# Altium schematic sheet LED.SchDoc
size A; SheetNumber: 1; SheetTotal: 1
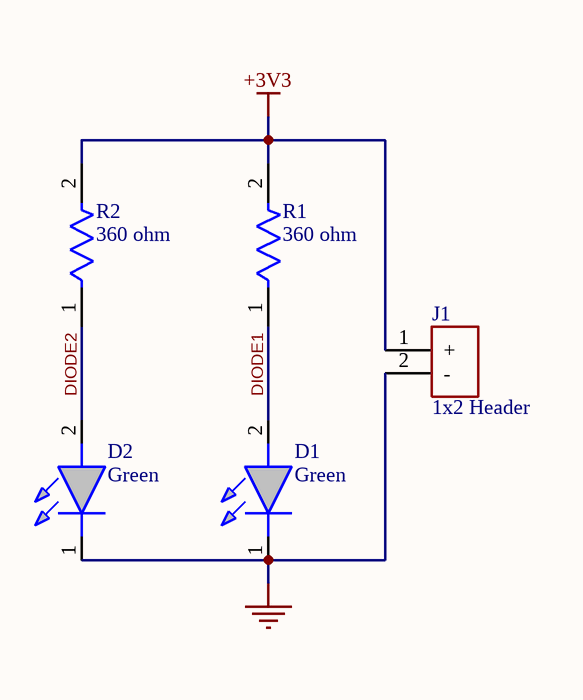
[diagram p0: LED.SchDoc]

## Parts
D1  Green  [LED0603Green]
D2  Green  [LED0603Green]
J1  1x2 Header  [HDR1x2]
R1  360 ohm  [R0805]
R2  360 ohm  [R0805]

## Nets
+3V3: J1.1(+) R1.2 R2.2
GND: D1.1(K) D2.1(K) J1.2(-)
DIODE1: D1.2(A) R1.1
DIODE2: D2.2(A) R2.1

## Library data of the parts
D1 D2 = LSM0603453V: Standard LEDs - SMD SMD 0603 3V 1000mcd GREEN; Manufacturer_Name: Visual Communications Company; Geometry.Height: 0.55mm; Mouser Part Number: 593-LSM0603453V; Mouser Price/Stock: https://www.mouser.co.uk/ProductDetail/VCC/LSM0603453V?qs=%252BEew9%252B0nqrBOKWP8d%2FyQXQ%3D%3D; Manufacturer_Part_Number: LSM0603453V; Datasheet Link: https://vcclite.com/wp-content/uploads/wpallimport/files/files/LSM0603453V.pdf
J1 = 22-27-2021: Conn Header Vert 2POS 2.54mm; Manufacturer: Molex; PartNumber: 0022272021; Current rating: 4A; Package Version: Rev. BC, 02/2012; Voltage rating: 250V; No. of Positions: 2; No. of Rows: 1; Orientation: Vertical; Operating temperature: 0°Cto+75°C; Manufacturer URL: http://www.molex.com/; Pitch: 2.54mm; Mounting Technology: ThroughHole; Housing material: Nylon(UL94V-0); Package Description: 2-Leads Header, Body 5.08 x 5.8 mm, Pitch 2.54 mm; Voltage - Max: 250V; Datasheet URL: http://www.molex.com/pdm_docs/sd/022272021_sd.pdf; Package Reference: 22-27-2021; Contact material: Tinplatedbrass; Current - Max: 4A; Datasheet Version: Rev. F, 06/2009
R1 R2 = CMP-03412-037214-1: RES SMD 360 OHM 1% 1/8W 0805; Manufacturer: Yageo; Manufacturer Part Number: AC0805FR-07360RL; Voltage Rating: 150V; Resistance: 360Ω; Tolerance: 0.01; Automotive Grade: Grade 0; Value: 360Ω; Temperature Range Low: -55°C; Footprint Url: http://www.yageo.com/exep/pages/download/literatures/PYu-R_Mount_10.pdf; Power Rating: 1/8W; Automotive: Yes; Height: 0.6mm; Composition: Thick Film; Digikey Description: RES SMD 360 OHM 1% 1/8W 0805; Category: Res; Ipc Land Pattern Name: RESC200125X50; Device Class L3: Chip SMD Resistors; ComponentLink2URL: http://www.yageo.com/documents/recent/PYu-AC_51_RoHS_L_6.pdf; Octopart: https://octopart.com/ac0805fr-07360rl-yageo-71367690; Device Class L1: Passive Components; ComponentLink2Description: Datasheet; Device Class L2: Resistors; Lead Free: Yes; Series: AC; Temperature: -55°C to +155°C; RoHS: TRUE; Package: AC0805; Temperature Range High: +155°C